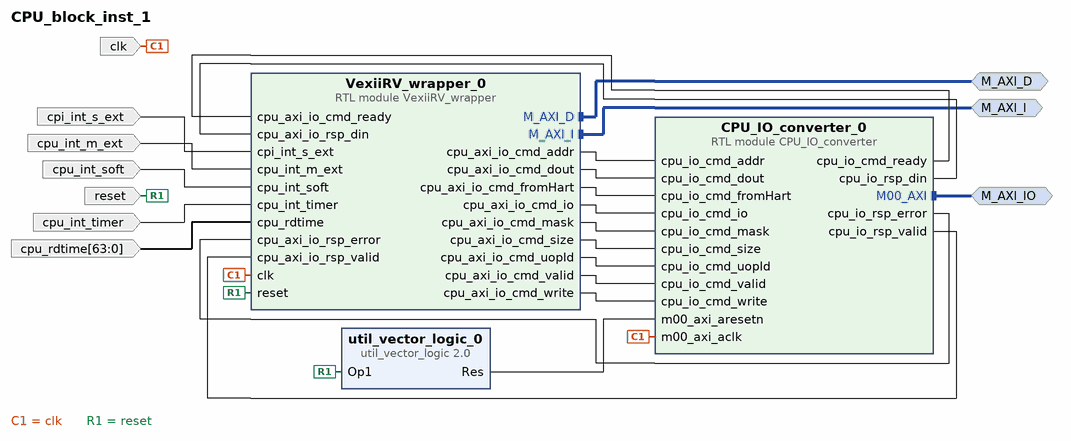
[diagram p0: block diagram of the top level]
# Vivado block design CPU_block_inst_1, xc7a35tftg256-2, Vivado 2025.2
create_bd_design CPU_block_inst_1

create_bd_intf_port -mode Master -vlnv xilinx.com:interface:aximm_rtl:1.0 M_AXI_D
create_bd_intf_port -mode Master -vlnv xilinx.com:interface:aximm_rtl:1.0 M_AXI_I
create_bd_intf_port -mode Master -vlnv xilinx.com:interface:aximm_rtl:1.0 M_AXI_IO
create_bd_port -dir I -type clk clk
create_bd_port -dir I -type rst reset
create_bd_port -dir I -from 63 -to 0 cpu_rdtime
create_bd_port -dir I cpu_int_timer
create_bd_port -dir I cpu_int_soft
create_bd_port -dir I cpu_int_m_ext
create_bd_port -dir I cpi_int_s_ext

create_bd_cell -type module -reference CPU_IO_converter CPU_IO_converter_0
create_bd_cell -type module -reference VexiiRV_wrapper VexiiRV_wrapper_0
create_bd_cell -type ip -vlnv xilinx.com:ip:util_vector_logic:2.0 util_vector_logic_0
set_property -dict {CONFIG.C_OPERATION not} [get_bd_cells util_vector_logic_0]

# ---- connections ----

connect_bd_intf_net [get_bd_intf_ports M_AXI_IO] [get_bd_intf_pins CPU_IO_converter_0/M00_AXI]
connect_bd_intf_net [get_bd_intf_ports M_AXI_D] [get_bd_intf_pins VexiiRV_wrapper_0/M_AXI_D]
connect_bd_intf_net [get_bd_intf_ports M_AXI_I] [get_bd_intf_pins VexiiRV_wrapper_0/M_AXI_I]
connect_bd_net [get_bd_pins CPU_IO_converter_0/cpu_io_cmd_ready] [get_bd_pins VexiiRV_wrapper_0/cpu_axi_io_cmd_ready]
connect_bd_net [get_bd_pins CPU_IO_converter_0/cpu_io_rsp_din] [get_bd_pins VexiiRV_wrapper_0/cpu_axi_io_rsp_din]
connect_bd_net [get_bd_pins CPU_IO_converter_0/cpu_io_rsp_error] [get_bd_pins VexiiRV_wrapper_0/cpu_axi_io_rsp_error]
connect_bd_net [get_bd_pins CPU_IO_converter_0/cpu_io_rsp_valid] [get_bd_pins VexiiRV_wrapper_0/cpu_axi_io_rsp_valid]
connect_bd_net [get_bd_pins VexiiRV_wrapper_0/cpu_axi_io_cmd_addr] [get_bd_pins CPU_IO_converter_0/cpu_io_cmd_addr]
connect_bd_net [get_bd_pins VexiiRV_wrapper_0/cpu_axi_io_cmd_dout] [get_bd_pins CPU_IO_converter_0/cpu_io_cmd_dout]
connect_bd_net [get_bd_pins VexiiRV_wrapper_0/cpu_axi_io_cmd_fromHart] [get_bd_pins CPU_IO_converter_0/cpu_io_cmd_fromHart]
connect_bd_net [get_bd_pins VexiiRV_wrapper_0/cpu_axi_io_cmd_io] [get_bd_pins CPU_IO_converter_0/cpu_io_cmd_io]
connect_bd_net [get_bd_pins VexiiRV_wrapper_0/cpu_axi_io_cmd_mask] [get_bd_pins CPU_IO_converter_0/cpu_io_cmd_mask]
connect_bd_net [get_bd_pins VexiiRV_wrapper_0/cpu_axi_io_cmd_size] [get_bd_pins CPU_IO_converter_0/cpu_io_cmd_size]
connect_bd_net [get_bd_pins VexiiRV_wrapper_0/cpu_axi_io_cmd_uopId] [get_bd_pins CPU_IO_converter_0/cpu_io_cmd_uopId]
connect_bd_net [get_bd_pins VexiiRV_wrapper_0/cpu_axi_io_cmd_valid] [get_bd_pins CPU_IO_converter_0/cpu_io_cmd_valid]
connect_bd_net -net VexiiRV_wrapper_0_cpu_axi_io_cmd_wite [get_bd_pins VexiiRV_wrapper_0/cpu_axi_io_cmd_write] \
  [get_bd_pins CPU_IO_converter_0/cpu_io_cmd_write]
connect_bd_net -net clk_0_1 [get_bd_ports clk] [get_bd_pins CPU_IO_converter_0/m00_axi_aclk] [get_bd_pins VexiiRV_wrapper_0/clk]
connect_bd_net -net cpi_int_s_ext_0_1 [get_bd_ports cpi_int_s_ext] [get_bd_pins VexiiRV_wrapper_0/cpi_int_s_ext]
connect_bd_net -net cpu_int_m_ext_0_1 [get_bd_ports cpu_int_m_ext] [get_bd_pins VexiiRV_wrapper_0/cpu_int_m_ext]
connect_bd_net -net cpu_int_soft_0_1 [get_bd_ports cpu_int_soft] [get_bd_pins VexiiRV_wrapper_0/cpu_int_soft]
connect_bd_net -net cpu_int_timer_0_1 [get_bd_ports cpu_int_timer] [get_bd_pins VexiiRV_wrapper_0/cpu_int_timer]
connect_bd_net -net cpu_rdtime_0_1 [get_bd_ports cpu_rdtime] [get_bd_pins VexiiRV_wrapper_0/cpu_rdtime]
connect_bd_net [get_bd_ports reset] [get_bd_pins util_vector_logic_0/Op1] [get_bd_pins VexiiRV_wrapper_0/reset]
connect_bd_net [get_bd_pins util_vector_logic_0/Res] [get_bd_pins CPU_IO_converter_0/m00_axi_aresetn]

# ---- address map ----
assign_bd_address -offset 0x10000000 -range 4K -target_address_space [get_bd_addr_spaces CPU_IO_converter_0/M00_AXI] [get_bd_addr_segs M_AXI_IO/:axi_uartlite_0:S_AXI:Reg]
assign_bd_address -offset 0x10001000 -range 4K -target_address_space [get_bd_addr_spaces CPU_IO_converter_0/M00_AXI] [get_bd_addr_segs M_AXI_IO/:axi_quad_spi_0:AXI_LITE:Reg]
assign_bd_address -offset 0x10002000 -range 4K -target_address_space [get_bd_addr_spaces CPU_IO_converter_0/M00_AXI] [get_bd_addr_segs M_AXI_IO/:axi_timer_0:S_AXI:Reg]
assign_bd_address -offset 0x80000000 -range 256M -target_address_space [get_bd_addr_spaces VexiiRV_wrapper_0/M_AXI_D] [get_bd_addr_segs M_AXI_D/:FLASH_SPI_wrapper_0:S_AXI:reg0]
assign_bd_address -offset 0x90000000 -range 256M -target_address_space [get_bd_addr_spaces VexiiRV_wrapper_0/M_AXI_D] [get_bd_addr_segs M_AXI_D/:mig_axi_wrapper_0:s_axi:reg0]
assign_bd_address -offset 0x80000000 -range 256M -target_address_space [get_bd_addr_spaces VexiiRV_wrapper_0/M_AXI_I] [get_bd_addr_segs M_AXI_I/:FLASH_SPI_wrapper_0:S_AXI:reg0]
assign_bd_address -offset 0x90000000 -range 256M -target_address_space [get_bd_addr_spaces VexiiRV_wrapper_0/M_AXI_I] [get_bd_addr_segs M_AXI_I/:mig_axi_wrapper_0:s_axi:reg0]

validate_bd_design
save_bd_design
